# Altium schematic sheet rightsuperior.SchDoc
size A
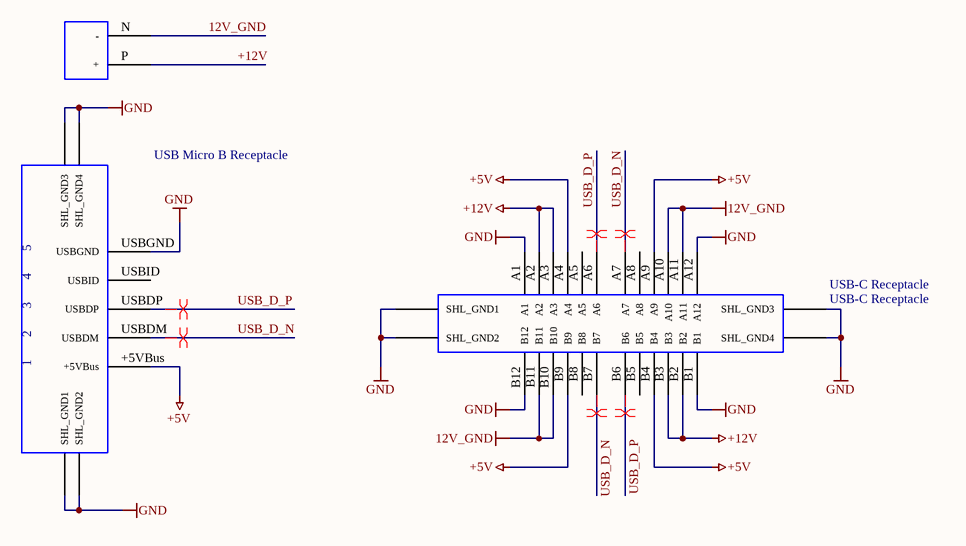
[diagram p0: rightsuperior.SchDoc]

## Parts
Screw_Header_-_2_pos  Screw Header - 2 pos  [SCREW HEADER - 2POS]  (value not drawn)
USB-C_Receptacle  USB-C Receptacle  [JAE USB RECEPTACLE]
USB_Micro_B_Receptacle  USB Micro B Receptacle  [USB Micro B Receptacle]  (value not drawn)

## Nets
12V_GND: Screw_Header_-_2_pos.N(-) USB-C_Receptacle.A10 USB-C_Receptacle.A11 USB-C_Receptacle.B10 USB-C_Receptacle.B11
+5V: USB-C_Receptacle.A4 USB-C_Receptacle.A9 USB-C_Receptacle.B4 USB-C_Receptacle.B9 USB_Micro_B_Receptacle.+5VBus
+12V: Screw_Header_-_2_pos.P(+) USB-C_Receptacle.A2 USB-C_Receptacle.A3 USB-C_Receptacle.B2 USB-C_Receptacle.B3
GND: USB-C_Receptacle.A1 USB-C_Receptacle.A12 USB-C_Receptacle.B1 USB-C_Receptacle.B12 USB-C_Receptacle.SHL_GND1 USB-C_Receptacle.SHL_GND2 USB-C_Receptacle.SHL_GND3 USB-C_Receptacle.SHL_GND4 USB_Micro_B_Receptacle.SHL_GND1 USB_Micro_B_Receptacle.SHL_GND2 USB_Micro_B_Receptacle.SHL_GND3 USB_Micro_B_Receptacle.SHL_GND4 USB_Micro_B_Receptacle.USBGND
USB_D_N: USB-C_Receptacle.A7 USB-C_Receptacle.B7 USB_Micro_B_Receptacle.USBDM
USB_D_P: USB-C_Receptacle.A6 USB-C_Receptacle.B6 USB_Micro_B_Receptacle.USBDP

Not connected (* = marked no-connect by the designer): USB-C_Receptacle A5 A8 B5 B8; USB_Micro_B_Receptacle USBID

## Layout directives
differential pair: USB_D_N, USB_D_P

## Notes on the sheet
- (in symbol USB Micro B Receptacle) 5; 4; 3; 2; 1

## Library data of the parts
Screw_Header_-_2_pos = Screw Header - 2 pos: On Shore Technology - OSTVN02A150; Supplier 1: Digi-Key; Supplier Part Number 1: ED10561-ND
USB-C_Receptacle = USB-C Receptacle: JAE DX07S024JJ2R1300; Supplier 1: Digi-Key; Supplier Part Number 1: 670-2794-6-ND; Supplier 2: Mouser; Supplier Part Number 2: 656-DX07S024JJ2R1300
USB_Micro_B_Receptacle = USB Micro B Receptacle: Wurth Electronics Inc - 629105150521; Supplier 1: Digi-Key; Supplier Part Number 1: 732-5960-1-ND